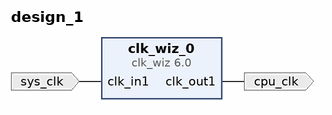
[diagram p0: block diagram of the top level]
# Vivado block design design_1, xc7a200tsbg484-1, Vivado 2020.1
create_bd_design design_1

create_bd_port -dir I sys_clk
create_bd_port -dir O cpu_clk

create_bd_cell -type ip -vlnv xilinx.com:ip:clk_wiz:6.0 clk_wiz_0
set_property -dict [list \
  CONFIG.CLKOUT1_JITTER 151.636 \
  CONFIG.CLKOUT1_REQUESTED_OUT_FREQ 50 \
  CONFIG.MMCM_CLKOUT0_DIVIDE_F 20.000 \
  CONFIG.USE_LOCKED false \
  CONFIG.USE_RESET false \
] [get_bd_cells clk_wiz_0]

# ---- connections ----

connect_bd_net [get_bd_pins clk_wiz_0/clk_out1] [get_bd_ports cpu_clk]
connect_bd_net [get_bd_ports sys_clk] [get_bd_pins clk_wiz_0/clk_in1]

validate_bd_design
save_bd_design
